# EAGLE design moth_v3_60mm_v3.0 (EAGLE 9.5.2)
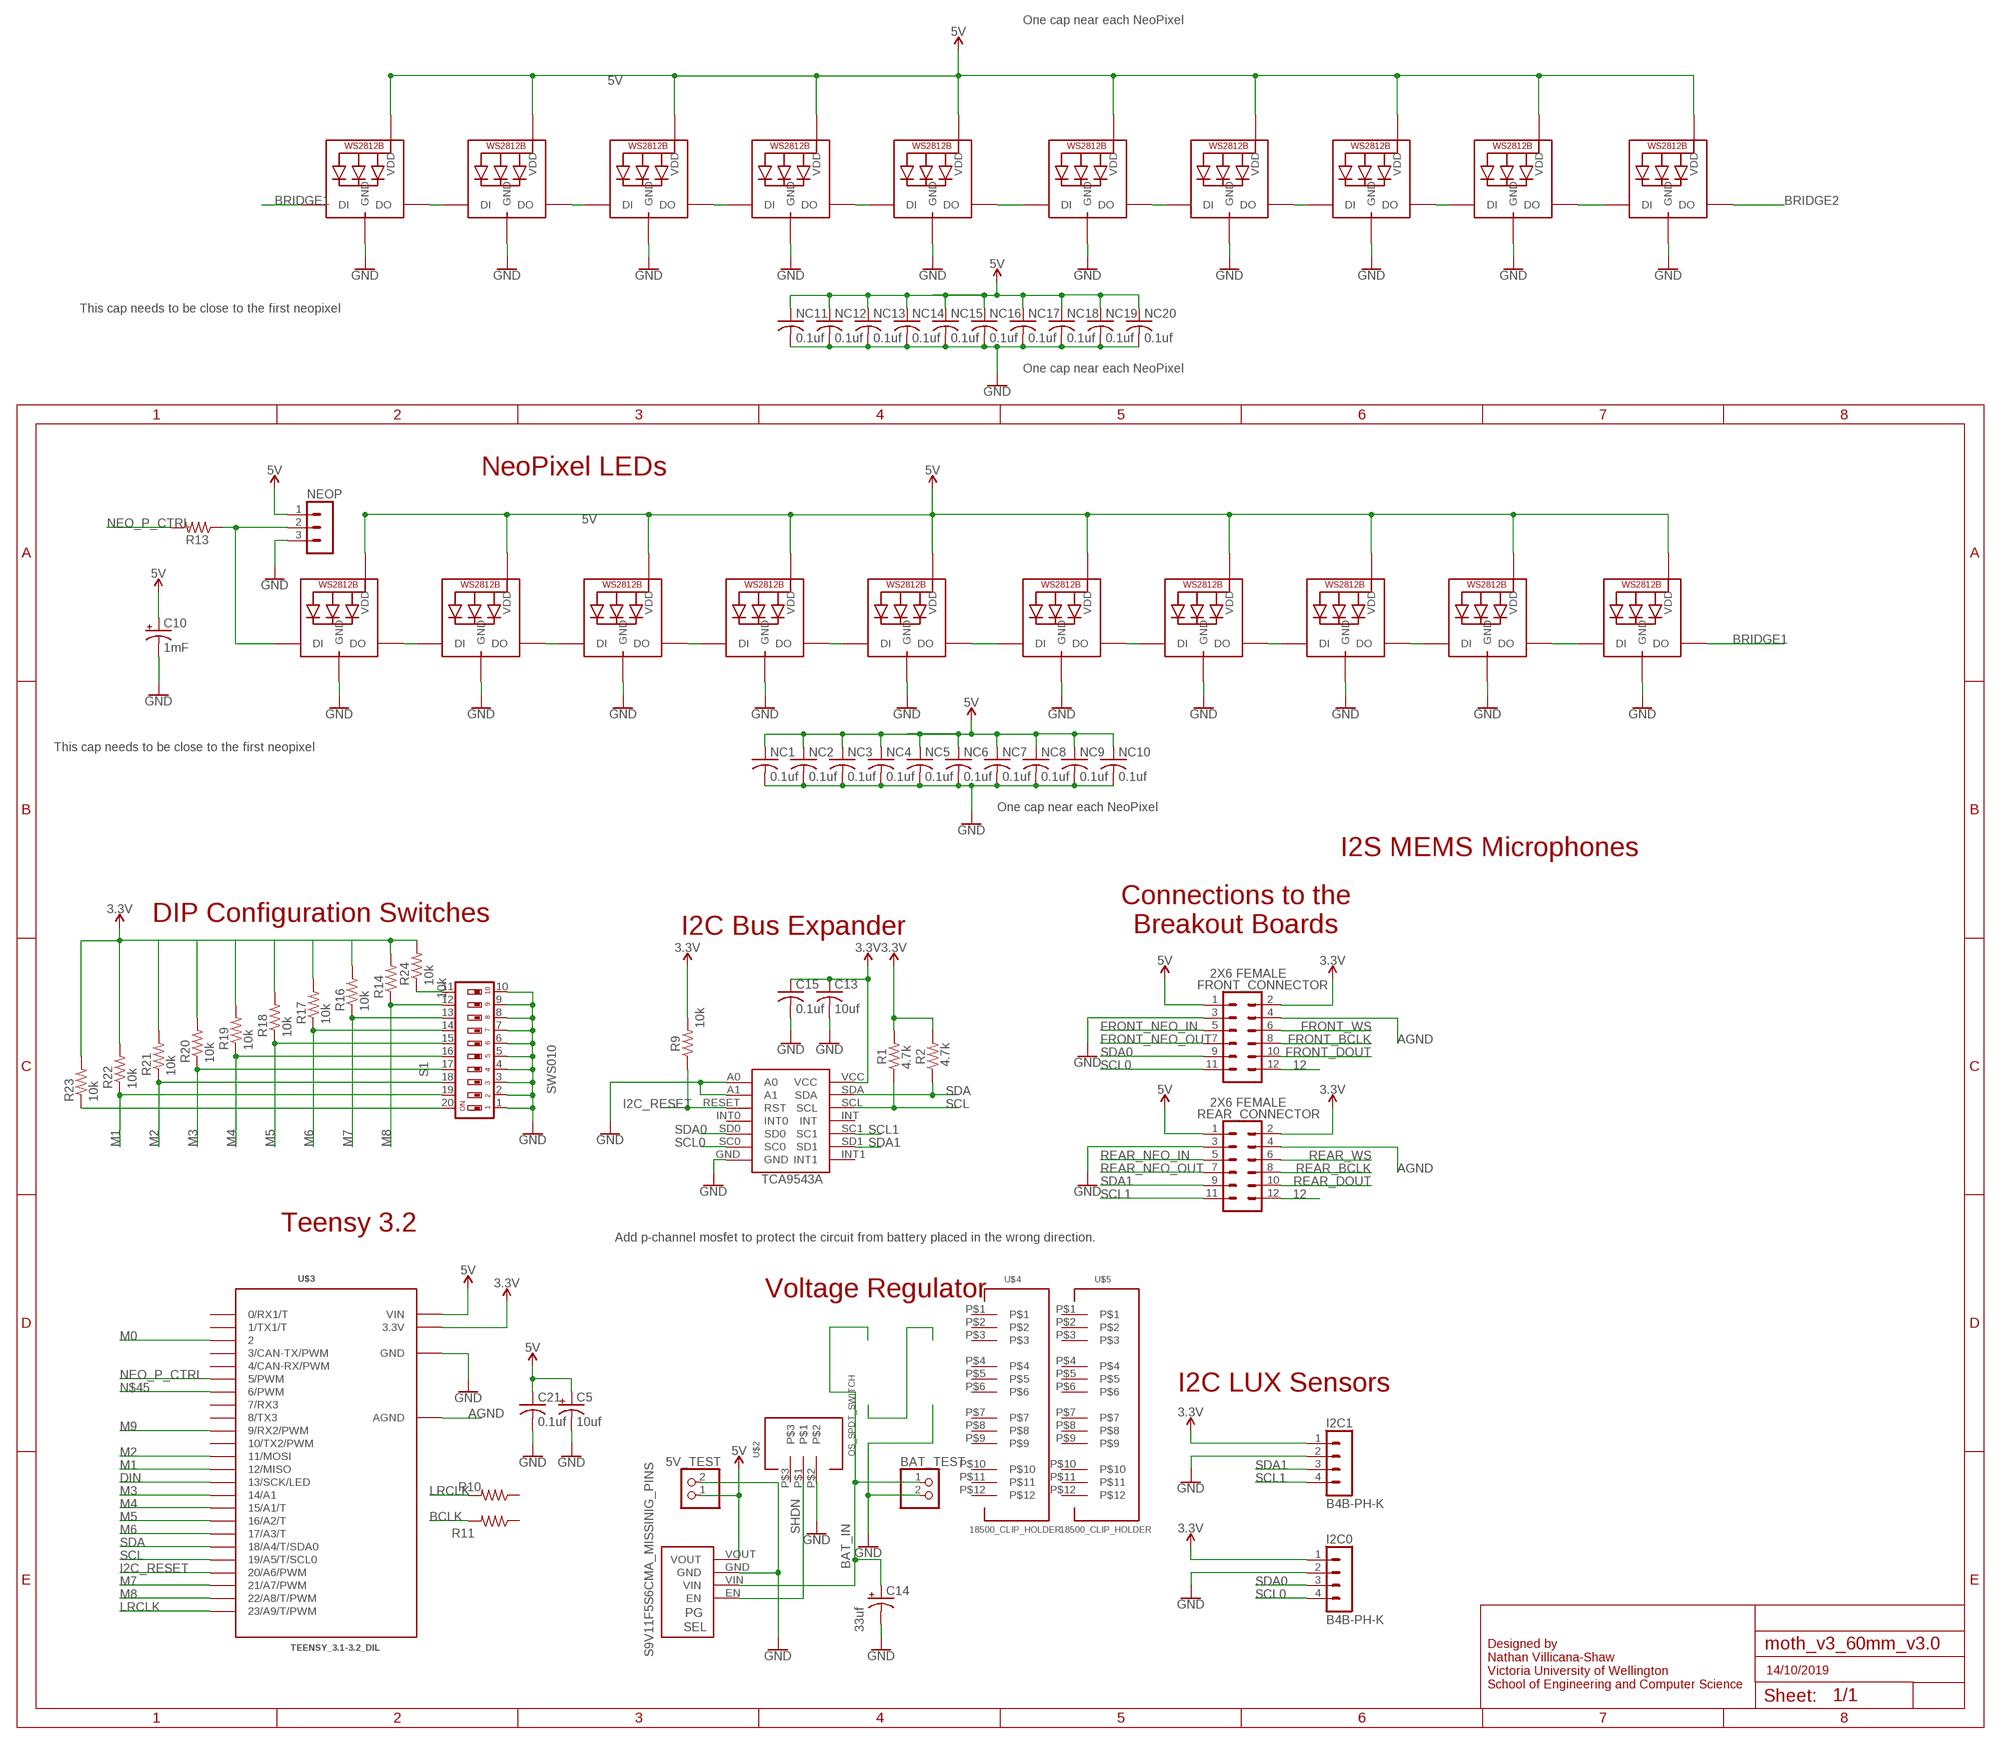
[diagram p0: schematic, sheet 1]

## Parts
5V_TEST  PINHD-1X2  [1X02]
BAT_TEST  PINHD-1X2  [1X02]
C5  10uf  CPOL-USE2.5-6  [E2,5-6]
C10  1mF  1000UF-RADIAL-5MM-25V-20%  [CPOL-RADIAL-5MM-10MM]
C13  10uf  C-USC1206K  [C1206K]
C14  33uf  CPOL-USE2-5  [E2-5]
C15  0.1uf  C-USC1206K  [C1206K]
C21  0.1uf  C-USC1206K  [C1206K]
FRONT_CONNECTOR  2X6 FEMALE  CONN_06X2PTH_FEMALE  [2X6]
I2C0  B4B-PH-K  [B4B-PH-K]
I2C1  B4B-PH-K  [B4B-PH-K]
NC1  0.1uf  C-USC1206K  [C1206K]
NC2  0.1uf  C-USC1206K  [C1206K]
NC3  0.1uf  C-USC1206K  [C1206K]
NC4  0.1uf  C-USC1206K  [C1206K]
NC5  0.1uf  C-USC1206K  [C1206K]
NC6  0.1uf  C-USC1206K  [C1206K]
NC7  0.1uf  C-USC1206K  [C1206K]
NC8  0.1uf  C-USC1206K  [C1206K]
NC9  0.1uf  C-USC1206K  [C1206K]
NC10  0.1uf  C-USC1206K  [C1206K]
NC11  0.1uf  C-USC1206K  [C1206K]
NC12  0.1uf  C-USC1206K  [C1206K]
NC13  0.1uf  C-USC1206K  [C1206K]
NC14  0.1uf  C-USC1206K  [C1206K]
NC15  0.1uf  C-USC1206K  [C1206K]
NC16  0.1uf  C-USC1206K  [C1206K]
NC17  0.1uf  C-USC1206K  [C1206K]
NC18  0.1uf  C-USC1206K  [C1206K]
NC19  0.1uf  C-USC1206K  [C1206K]
NC20  0.1uf  C-USC1206K  [C1206K]
NEO1  WS2812B5050  [WS2812B]
NEO2  WS2812B5050  [WS2812B]
NEO3  WS2812B5050  [WS2812B]
NEO4  WS2812B5050  [WS2812B]
NEO5  WS2812B5050  [WS2812B]
NEO6  WS2812B5050  [WS2812B]
NEO7  WS2812B5050  [WS2812B]
NEO8  WS2812B5050  [WS2812B]
NEO9  WS2812B5050  [WS2812B]
NEO10  WS2812B5050  [WS2812B]
NEO11  WS2812B5050  [WS2812B]
NEO12  WS2812B5050  [WS2812B]
NEO13  WS2812B5050  [WS2812B]
NEO14  WS2812B5050  [WS2812B]
NEO15  WS2812B5050  [WS2812B]
NEO16  WS2812B5050  [WS2812B]
NEO17  WS2812B5050  [WS2812B]
NEO18  WS2812B5050  [WS2812B]
NEO19  WS2812B5050  [WS2812B]
NEO20  WS2812B5050  [WS2812B]
NEOP  B3B-PH-K  [B3B-PH-K]
R1  4.7k  R-US_R1206W  [R1206W]
R2  4.7k  R-US_R1206W  [R1206W]
R9  10k  R-US_R1206W  [R1206W]
R10  68R  R-US_M1206  [M1206]
R11  68R  R-US_M1206  [M1206]
R13  300 R  R-US_R1206W  [R1206W]
R14  10k  R-US_R1206W  [R1206W]
R16  10k  R-US_R1206W  [R1206W]
R17  10k  R-US_R1206W  [R1206W]
R18  10k  R-US_R1206W  [R1206W]
R19  10k  R-US_R1206W  [R1206W]
R20  10k  R-US_R1206W  [R1206W]
R21  10k  R-US_R1206W  [R1206W]
R22  10k  R-US_R1206W  [R1206W]
R23  10k  R-US_R1206W  [R1206W]
R24  10k  R-US_R1206W  [R1206W]
REAR_CONNECTOR  2X6 FEMALE  CONN_06X2PTH_FEMALE  [2X6]
S1  SWS010  [SMS-010]
U$1  TCA9543A  [SO14]
U$2  OS_SPDT_SWITCH  [OS_SPDT_SLIDE_SWITCH]
U$3  TEENSY_3.1-3.2_DIL  [TEENSY_3.0-3.2&LC_DIL]
U$4  18500_CLIP_HOLDER  [3PINBATTERY_CLIP]
U$5  18500_CLIP_HOLDER  [3PINBATTERY_CLIP]
U$6  S9V11F5S6CMA_MISSINIG_PINS  [S9V11F3S5CMA_MISSING_PINS]

## Nets
3.3V: C13.1 C15.1 FRONT_CONNECTOR.2 I2C0.1 I2C1.1 R1.2 R2.2 R9.2 R14.2 R22.2 R23.2 R24.2 REAR_CONNECTOR.2 U$1.VCC U$3.3.3V
5V: 5V_TEST.1 C5.+ C10.+ C21.1 FRONT_CONNECTOR.1 NC1.1 NC2.1 NC3.1 NC4.1 NC5.1 NC6.1 NC7.1 NC8.1 NC9.1 NC10.1 NC11.1 NC12.1 NC13.1 NC14.1 NC15.1 NC16.1 NC17.1 NC18.1 NC19.1 NC20.1 NEO1.1-VDD(VDD) NEO2.1-VDD(VDD) NEO3.1-VDD(VDD) NEO4.1-VDD(VDD) NEO5.1-VDD(VDD) NEO6.1-VDD(VDD) NEO7.1-VDD(VDD) NEO8.1-VDD(VDD) NEO9.1-VDD(VDD) NEO10.1-VDD(VDD) NEO11.1-VDD(VDD) NEO12.1-VDD(VDD) NEO13.1-VDD(VDD) NEO14.1-VDD(VDD) NEO15.1-VDD(VDD) NEO16.1-VDD(VDD) NEO17.1-VDD(VDD) NEO18.1-VDD(VDD) NEO19.1-VDD(VDD) NEO20.1-VDD(VDD) NEOP.1 REAR_CONNECTOR.1 U$3.VIN U$6.VOUT
12: FRONT_CONNECTOR.12 REAR_CONNECTOR.12
AGND: FRONT_CONNECTOR.4 REAR_CONNECTOR.4 U$3.AGND
BAT_IN: BAT_TEST.1 C14.+ U$6.VIN
BCLK: R11.2
BRIDGE1: NEO10.2-DOUT(DO) NEO14.4-DIN(DI)
BRIDGE2: NEO20.2-DOUT(DO)
DIN: U$3.13(13/SCK/LED)
FRONT_BCLK: FRONT_CONNECTOR.8
FRONT_DOUT: FRONT_CONNECTOR.10
FRONT_NEO_IN: FRONT_CONNECTOR.5
FRONT_NEO_OUT: FRONT_CONNECTOR.7
FRONT_WS: FRONT_CONNECTOR.6
GND: 5V_TEST.2 BAT_TEST.2 C5.- C10.- C13.2 C14.- C15.2 C21.2 FRONT_CONNECTOR.3 I2C0.2 I2C1.2 NC1.2 NC2.2 NC3.2 NC4.2 NC5.2 NC6.2 NC7.2 NC8.2 NC9.2 NC10.2 NC11.2 NC12.2 NC13.2 NC14.2 NC15.2 NC16.2 NC17.2 NC18.2 NC19.2 NC20.2 NEO1.3-GND(GND) NEO2.3-GND(GND) NEO3.3-GND(GND) NEO4.3-GND(GND) NEO5.3-GND(GND) NEO6.3-GND(GND) NEO7.3-GND(GND) NEO8.3-GND(GND) NEO9.3-GND(GND) NEO10.3-GND(GND) NEO11.3-GND(GND) NEO12.3-GND(GND) NEO13.3-GND(GND) NEO14.3-GND(GND) NEO15.3-GND(GND) NEO16.3-GND(GND) NEO17.3-GND(GND) NEO18.3-GND(GND) NEO19.3-GND(GND) NEO20.3-GND(GND) NEOP.3 REAR_CONNECTOR.3 S1.1 S1.2 S1.3 S1.4 S1.5 S1.6 S1.7 S1.8 S1.9 S1.10 U$1.A0 U$1.A1 U$1.GND U$2.P$2 U$3.GND U$6.GND
I2C_RESET: R9.1 U$1.RESET(RST) U$3.20/A6(20/A6/PWM)
LRCLK: R10.2 U$3.23/A9(23/A9/T/PWM)
M0: U$3.2
M1: R22.1 S1.19 U$3.12(12/MISO)
M2: R21.1 S1.18 U$3.11(11/MOSI)
M3: R20.1 S1.17 U$3.14/A0(14/A1)
M4: R19.1 S1.16 U$3.15/A1(15/A1/T)
M5: R18.1 S1.15 U$3.16/A2(16/A2/T)
M6: R17.1 S1.14 U$3.17/A3(17/A3/T)
M7: R16.1 S1.13 U$3.21/A7(21/A7/PWM)
M8: R14.1 S1.12 U$3.22/A8(22/A8/T/PWM)
M9: U$3.9(9/RX2/PWM)
N$4: NEO2.2-DOUT(DO) NEO3.4-DIN(DI)
N$5: NEO5.2-DOUT(DO) NEO6.4-DIN(DI)
N$6: NEO9.2-DOUT(DO) NEO10.4-DIN(DI)
N$7: NEO11.2-DOUT(DO) NEO12.4-DIN(DI)
N$8: NEO4.2-DOUT(DO) NEO5.4-DIN(DI)
N$9: NEO15.2-DOUT(DO) NEO16.4-DIN(DI)
N$10: NEO3.2-DOUT(DO) NEO4.4-DIN(DI)
N$11: NEO7.2-DOUT(DO) NEO8.4-DIN(DI)
N$12: NEO8.2-DOUT(DO) NEO9.4-DIN(DI)
N$13: NEO17.2-DOUT(DO) NEO18.4-DIN(DI)
N$14: NEO18.2-DOUT(DO) NEO19.4-DIN(DI)
N$15: NEO11.4-DIN(DI) NEO16.2-DOUT(DO)
N$16: NEO13.2-DOUT(DO) NEO17.4-DIN(DI)
N$18: NEO12.2-DOUT(DO) NEO13.4-DIN(DI)
N$19: NEO19.2-DOUT(DO) NEO20.4-DIN(DI)
N$22: R21.2
N$23: NEO6.2-DOUT(DO) NEO7.4-DIN(DI)
N$24: R20.2
N$25: R19.2
N$26: R18.2
N$27: R17.2
N$28: R16.2
N$44: R24.1 S1.11
N$45: U$3.6(6/PWM)
N$46: R23.1 S1.20
NEO_P1: NEO1.2-DOUT(DO) NEO2.4-DIN(DI)
NEO_P2: NEO14.2-DOUT(DO) NEO15.4-DIN(DI)
NEO_P_CTRL: R13.2 U$3.5(5/PWM)
NEO_P_CTRL_INT: NEO1.4-DIN(DI) NEOP.2 R13.1
REAR_BCLK: REAR_CONNECTOR.8
REAR_DOUT: REAR_CONNECTOR.10
REAR_NEO_IN: REAR_CONNECTOR.5
REAR_NEO_OUT: REAR_CONNECTOR.7
REAR_WS: REAR_CONNECTOR.6
SCL: R1.1 U$1.SCL U$3.19/A5(19/A5/T/SCL0)
SCL0: FRONT_CONNECTOR.11 I2C0.4 U$1.SC0
SCL1: I2C1.4 REAR_CONNECTOR.11 U$1.SC1
SDA: R2.1 U$1.SDA U$3.18/A4(18/A4/T/SDA0)
SDA0: FRONT_CONNECTOR.9 I2C0.3 U$1.SD0
SDA1: I2C1.3 REAR_CONNECTOR.9 U$1.SD1
SHDN: U$2.P$1 U$6.EN
Unconnected: R10.1 R11.1 U$1.INT U$1.INT0 U$1.INT1 U$2.P$3 U$3.0(0/RX1/T) U$3.1(1/TX1/T) U$3.3(3/CAN-TX/PWM) U$3.4(4/CAN-RX/PWM) U$3.7(7/RX3) U$3.8(8/TX3) U$3.10(10/TX2/PWM) U$4.P$1 U$4.P$2 U$4.P$3 U$4.P$4 U$4.P$5 U$4.P$6 U$4.P$7 U$4.P$8 U$4.P$9 U$4.P$10 U$4.P$11 U$4.P$12 U$5.P$1 U$5.P$2 U$5.P$3 U$5.P$4 U$5.P$5 U$5.P$6 U$5.P$7 U$5.P$8 U$5.P$9 U$5.P$10 U$5.P$11 U$5.P$12

## Notes on the sheet
- One cap near each NeoPixel
- This cap needs to be close to the first neopixel
- One cap near each NeoPixel
- NeoPixel LEDs
- This cap needs to be close to the first neopixel
- One cap near each NeoPixel
- I2S MEMS Microphones
- Connections to the
  Breakout Boards
- DIP Configuration Switches
- I2C Bus Expander
- 10k
- 4.7k | 4.7k
- Teensy 3.2
- Add p-channel mosfet to protect the circuit from battery placed in the wrong direction.
- Voltage Regulator
- I2C LUX Sensors
- 14/10/2019
- Designed by
  Nathan Villicana-Shaw
  Victoria University of Wellington
  School of Engineering and Computer Science

## Library data of the parts
5V_TEST BAT_TEST = pinhead:PINHD-1X2: PIN HEADER
C5 C14 = adafruit:CPOL-US: POLARIZED CAPACITOR, American symbol
C10 = SparkFun-Capacitors:1000UF: 1,000µF/1mF ceramic capacitors A capacitor is a passive two-terminal electrical component used to store electrical energy temporarily in an electric field. CAP-08070; PROD_ID: CAP-09538
C13 C15 C21 NC1-NC20 = adafruit:C-US: CAPACITOR, American symbol
FRONT_CONNECTOR REAR_CONNECTOR = SparkFun-Connectors:CONN_06X2: Multi connection point. Often used as Generic Header-pin footprint for 0.1 inch spaced/style header connections On any of the 0.1 inch spaced packages, you can populate with these: Break Away Headers - Straight <https://www.sparkfun.com/products/116> (PRT-00116) Break Away Male Headers - Right Angle <https://www.sparkfun.com/products/553> (PRT-00553) Female Headers <https://www.sparkfun.com/products/115> (PRT-00115) Break Away Headers - Machine Pin <https://www.sparkfun.com/products/117> (PRT-00117) Break Away Female Headers - Swiss Machine Pin <https://www.sparkfun.com/products/743> (PRT-00743); PROD_ID: CONN-12423
I2C0 I2C1 = con-jst-ph:B4B-PH-K: HEADER
NEO1-NEO20 = adafruit:WS2812B
NEOP = con-jst-ph:B3B-PH-K: HEADER
R1 R2 R9-R11 R13 R14 R16-R24 = adafruit:R-US_: RESISTOR, American symbol
S1 = smd-special:SWS010: SMD Dip Switch 10 pol.
U$1 = nathans-custom-parts:TCA9543A
U$2 = nathans-custom-parts:OS_SPDT_SWITCH
U$3 = Teensy_3_and_LC_Series_Boards_v1.4:TEENSY_3.1-3.2_DIL: Teensy 3.1 or 3.2 in a DIL Layout.
U$4 U$5 = nathans-custom-parts:18500_CLIP_HOLDER
U$6 = nathans-custom-parts:S9V11F5S6CMA_MISSINIG_PINS

## Net classes
0 default: width 0.203 mm, drill 0.254 mm, clearance 0.203 mm

## Board
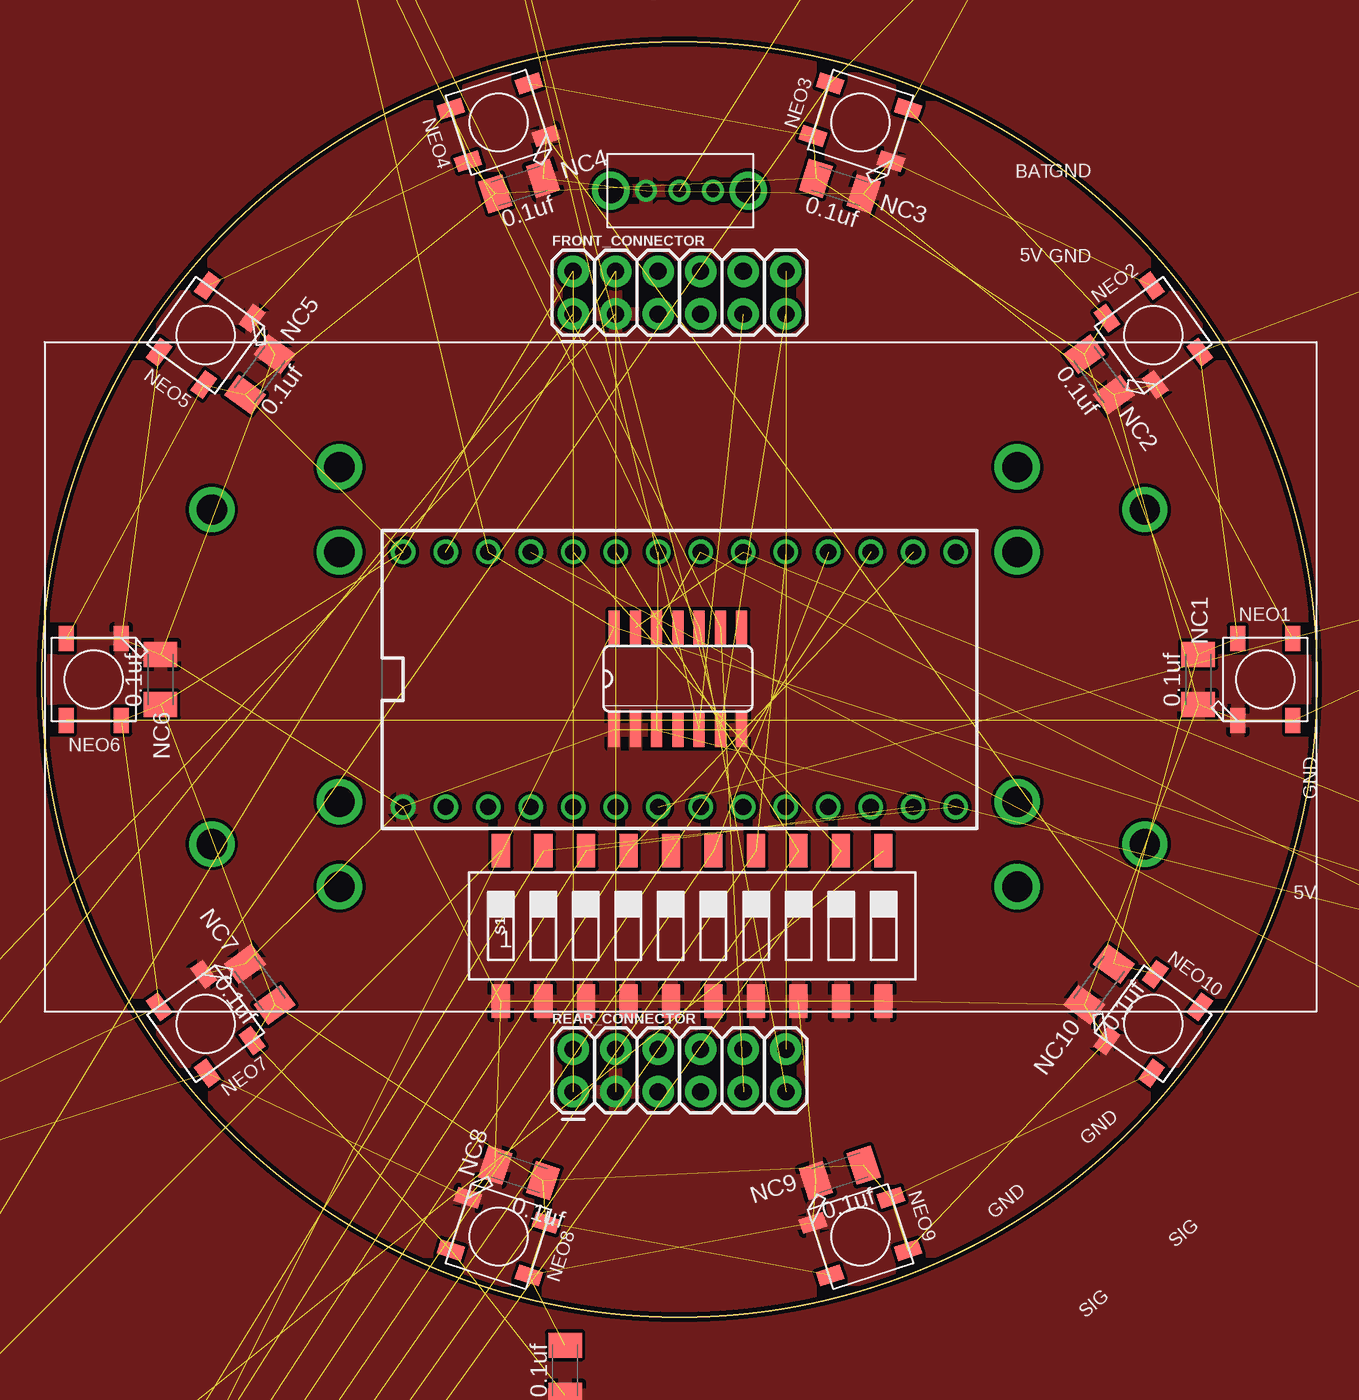
[diagram p1: board, top side]
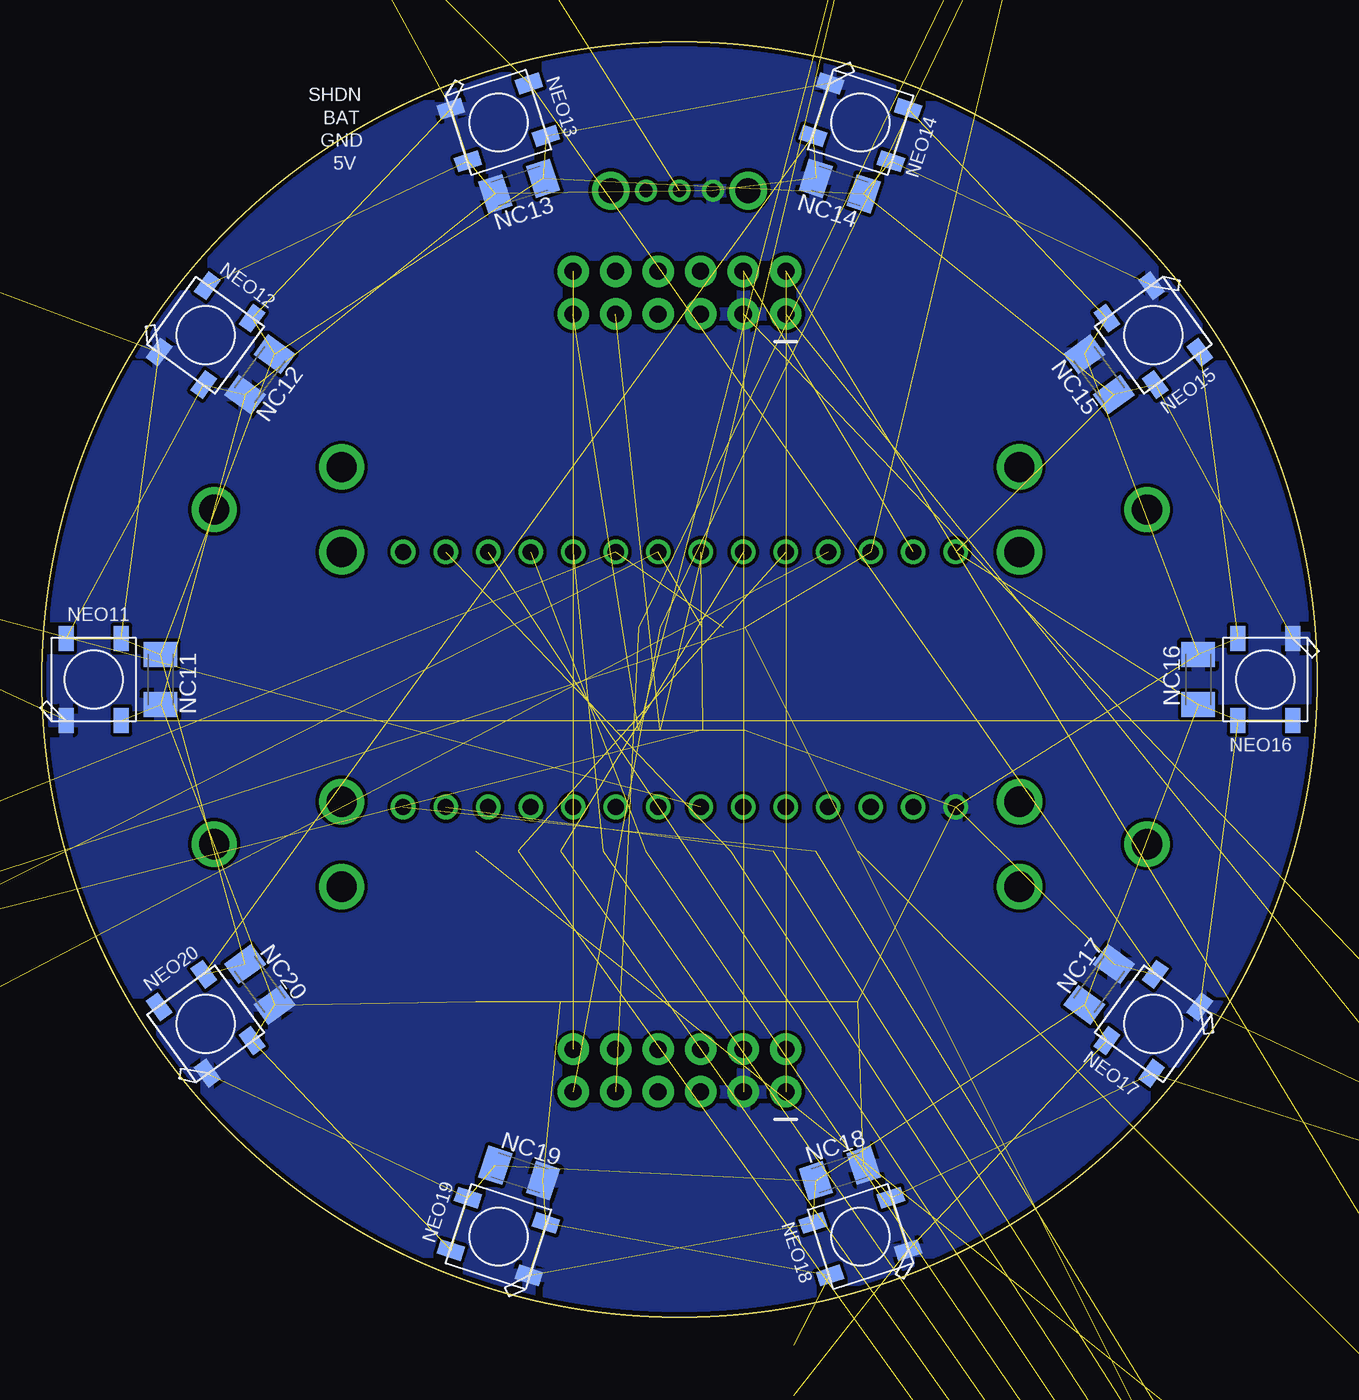
[diagram p2: board, bottom side, seen from below]

Size 76.2 x 76.2 mm. Coordinates in mm from the lower left corner, seen from the top.
Outline: circle at 38.1,38.1 radius 38.1
Copper layers (1*16): Top 0.035mm / dielectric 1.5mm / Bottom 0.035mm
Design rules "SeeedStudio_2layer_DRU_no_angle_20140221": minimum track width 6mil, minimum drill 12mil, track to track 6mil, track to pad 6mil, pad to pad 6mil, via to via 6mil, smd to smd 0mil, copper to edge 10mil, drill to drill 10mil, minimum pad ring 10mil, minimum via ring 6mil, stop-mask expansion 2mil, vias tented up to drill 100mil, thermal gap 10mil

### Footprints (pad centres in the part's own frame; a part is rotated, then mirrored left to right if it is on the bottom)
1X02 = drill 1.016 long: 1 -1.27,0; 2 1.27,0
E2,5-6 = drill 0.813 pad 1.778: + -1.27,0 | drill 0.813 pad 1.778 octagon: - 1.27,0
CPOL-RADIAL-5MM-10MM = drill 0.9 pad 1.93 square: + 2.5,0 | drill 0.9 pad 1.93: - -2.5,0
C1206K = smd 1.5 x 2: 1 -1.5,0; 2 1.5,0
E2-5 = drill 0.813 pad 1.422: + -1.016,0 | drill 0.813 pad 1.422 octagon: - 1.016,0
2X6 = drill 1.016 pad 1.88: 1 0,0; 2 0,2.54; 3 2.54,0; 4 2.54,2.54; 5 5.08,0; 6 5.08,2.54; 7 7.62,0; 8 7.62,2.54; 9 10.16,0; 10 10.16,2.54; 11 12.7,0; 12 12.7,2.54
B4B-PH-K = drill 0.813 square: 1 -3,0 | drill 0.813 octagon: 2 -1,0; 3 1,0; 4 3,0
WS2812B = smd 1.5 x 0.9: 1-VDD 2.45,-1.65; 2-DOUT 2.45,1.65; 3-GND -2.45,1.65; 4-DIN -2.45,-1.65
B3B-PH-K = drill 0.813 square: 1 -2,0 | drill 0.813 octagon: 2 0,0; 3 2,0
R1206W = smd 1.8 x 1.2: 1 -1.499,0; 2 1.499,0
M1206 = smd 1.6 x 2: 1 -1.4,0; 2 1.4,0
SMS-010 = smd 1.092 x 2.007: 1 -11.43,-4.496; 2 -8.89,-4.496; 3 -6.35,-4.496; 4 -3.81,-4.496; 5 -1.27,-4.496; 6 1.27,-4.496; 7 3.81,-4.496; 8 6.35,-4.496; 9 8.89,-4.496; 10 11.43,-4.496; 11 11.43,4.496; 12 8.89,4.496; 13 6.35,4.496; 14 3.81,4.496; 15 1.27,4.496; 16 -1.27,4.496; 17 -3.81,4.496; 18 -6.35,4.496; 19 -8.89,4.496; 20 -11.43,4.496
SO14 = smd 0.66 x 2.032: A0 -3.81,-3.073; A1 -2.54,-3.073; GND 3.81,-3.073; INT 0,3.073; INT0 0,-3.073; INT1 3.81,3.073; RESET -1.27,-3.073; SC0 2.54,-3.073; SC1 1.27,3.073; SCL -1.27,3.073; SD0 1.27,-3.073; SD1 2.54,3.073; SDA -2.54,3.073; VCC -3.81,3.073
OS_SPDT_SLIDE_SWITCH = drill 0.8: P$1 0,0; P$2 2,0; P$3 -2,0 | drill 1.5: P$4 4.1,0; P$5 -4.1,0
TEENSY_3.0-3.2&LC_DIL = drill 0.965: 0 -7.62,13.97; 1 -7.62,11.43; 2 -7.62,8.89; 3 -7.62,6.35; 3.3V 7.62,11.43; 4 -7.62,3.81; 5 -7.62,1.27; 6 -7.62,-1.27; 7 -7.62,-3.81; 8 -7.62,-6.35; 9 -7.62,-8.89; 10 -7.62,-11.43; 11 -7.62,-13.97; 12 -7.62,-16.51; 13 7.62,-16.51; 14/A0 7.62,-13.97; 15/A1 7.62,-11.43; 16/A2 7.62,-8.89; 17/A3 7.62,-6.35; 18/A4 7.62,-3.81; 19/A5 7.62,-1.27; 20/A6 7.62,1.27; 21/A7 7.62,3.81; 22/A8 7.62,6.35; 23/A9 7.62,8.89; AGND 7.62,13.97; GND -7.62,16.51; VIN 7.62,16.51
3PINBATTERY_CLIP = drill 1.8: P$1 0,0; P$2 7.62,2.54; P$3 7.62,-2.54; P$4 48.12,2.54; P$5 48.12,-2.54; P$6 55.74,0; P$7 0,-20; P$8 7.62,-17.46; P$9 7.62,-22.54; P$10 48.12,-17.46; P$11 48.12,-22.54; P$12 55.74,-20
S9V11F3S5CMA_MISSING_PINS = drill 0.85: EN 0,0; VIN 2.54,0; VOUT 7.62,0 | drill 0.85 square: GND 5.08,0

### Placement (x,y rotation side)
5V_TEST  62.23,90.13 90 top  (outside the outline)
BAT_TEST  62.28,95.79 270 top  (outside the outline)
C5  99.82,69.66 0 top  (outside the outline)
C10  -12.7,8.13 0 top  (outside the outline)
C13  10.12,124.17 0 top  (outside the outline)
C14  54.32,96 269 top  (outside the outline)
C15  10.15,121.62 0 top  (outside the outline)
C21  31.27,-3.17 270 top
FRONT_CONNECTOR  31.75,59.94 0 top
I2C0  18.71,122.27 270 top  (outside the outline)
I2C1  1.56,122.42 270 bottom  (outside the outline)
NC1  69.1,38.1 270 top
NC2  63.18,56.32 306 top
NC3  47.68,67.58 342 top
NC4  28.52,67.58 18 top
NC5  13.02,56.32 54 top
NC6  7.1,38.1 90 top
NC7  13.02,19.88 126 top
NC8  28.52,8.62 162 top
NC9  47.68,8.62 198 top
NC10  63.18,19.88 234 top
NC11  69.1,38.1 270 bottom
NC12  63.18,56.32 234 bottom
NC13  47.68,67.58 198 bottom
NC14  28.52,67.58 162 bottom
NC15  13.02,56.32 126 bottom
NC16  7.1,38.1 90 bottom
NC17  13.02,19.88 54 bottom
NC18  28.52,8.62 18 bottom
NC19  47.68,8.62 342 bottom
NC20  63.18,19.88 306 bottom
NEO1  73.1,38.1 90 top
NEO2  66.42,58.67 126 top
NEO3  48.92,71.39 162 top
NEO4  27.28,71.39 198 top
NEO5  9.78,58.67 234 top
NEO6  3.1,38.1 270 top
NEO7  9.78,17.53 306 top
NEO8  27.28,4.81 342 top
NEO9  48.92,4.81 18 top
NEO10  66.42,17.53 54 top
NEO11  73.1,38.1 90 bottom
NEO12  66.42,58.67 54 bottom
NEO13  48.92,71.39 18 bottom
NEO14  27.28,71.39 342 bottom
NEO15  9.78,58.67 306 bottom
NEO16  3.1,38.1 270 bottom
NEO17  9.78,17.53 234 bottom
NEO18  27.28,4.81 198 bottom
NEO19  48.92,4.81 162 bottom
NEO20  66.42,17.53 126 bottom
NEOP  75.98,93.36 90 top  (outside the outline)
R1  108.67,11.46 0 top  (outside the outline)
R2  109.92,18.8 0 top  (outside the outline)
R9  98.24,19.79 0 top  (outside the outline)
R10  108.07,5.06 180 top  (outside the outline)
R11  102.24,51.51 180 top  (outside the outline)
R13  94.49,45.47 180 top  (outside the outline)
R14  2.03,-37.85 0 top  (outside the outline)
R16  2.03,-35.31 0 top  (outside the outline)
R17  2.03,-32.77 0 top  (outside the outline)
R18  2.03,-30.23 0 top  (outside the outline)
R19  2.03,-27.69 0 top  (outside the outline)
R20  2.03,-25.15 0 top  (outside the outline)
R21  2.03,-22.61 0 top  (outside the outline)
R22  2.03,-20.07 0 top  (outside the outline)
R23  -31.24,-32.51 0 top  (outside the outline)
R24  -31.24,-38.61 0 top  (outside the outline)
REAR_CONNECTOR  31.75,13.46 0 top
S1  38.86,23.37 0 top
U$1  38,38.14 0 top
U$2  38.1,67.31 180 top
U$3  38.1,38.1 90 top
U$4  10.16,48.26 0 top
U$5  -23.88,-51.82 0 top  (outside the outline)
U$6  58.61,99.77 270 bottom  (outside the outline)

### Tracks (layer width: path | path; a pad name or v marks a point on that pad's centre or on a via)
3.3V  (14 unrouted)
5V  (48 unrouted)
12  (1 unrouted)
AGND  (2 unrouted)
BAT_IN  (2 unrouted)
BRIDGE1  (1 unrouted)
GND  (68 unrouted)
  pour Top: -19.9,87.1 91.1,87.1 91.1,-13.9 -19.9,-13.9
  pour Bottom: 59.87,87 91.01,55.85 91.01,18.03 58.75,-14.22 19.91,-14.22 -20.17,25.86 -19.86,87.02
I2C_RESET  (2 unrouted)
LRCLK  (1 unrouted)
M1  (2 unrouted)
M2  (2 unrouted)
M3  (2 unrouted)
M4  (2 unrouted)
M5  (2 unrouted)
M6  (2 unrouted)
M7  (2 unrouted)
M8  (2 unrouted)
N$4  (1 unrouted)
N$5  (1 unrouted)
N$6  (1 unrouted)
N$7  (1 unrouted)
N$8  (1 unrouted)
N$9  (1 unrouted)
N$10  (1 unrouted)
N$11  (1 unrouted)
N$12  (1 unrouted)
N$13  (1 unrouted)
N$14  (1 unrouted)
N$15  (1 unrouted)
N$16  (1 unrouted)
N$18  (1 unrouted)
N$19  (1 unrouted)
N$23  (1 unrouted)
N$44  (1 unrouted)
N$46  (1 unrouted)
NEO_P1  (1 unrouted)
NEO_P2  (1 unrouted)
NEO_P_CTRL  (1 unrouted)
NEO_P_CTRL_INT  (2 unrouted)
SCL  (2 unrouted)
SCL0  (2 unrouted)
SCL1  (2 unrouted)
SDA  (2 unrouted)
SDA0  (2 unrouted)
SDA1  (2 unrouted)
SHDN  (1 unrouted)

### Text on the board
tNames: 3.3V | AGND | BCLK | DATA | 3.3V | LRCLK | GND | SHDN | GND | BAT | GND | 5V | /Users/nathan/Desktop/moth_01.bmp | GND | CTRL | 5V | GND | GND | SIG | SIG | Moth v2.1 | Designed by / Nathan Villicana-Shaw | 2019
bNames: GND | GND | 3.3V | BCLK | DATA | LRCLK | Moth v2.1 | SHDN | BAT | GND | 5V